# Altium schematic sheet 08_USB_CONTROLLER.SchDoc: =title
size A3; Organization: 六零加智能科技; Address4: www.nidone.com.cn; DocumentNumber: kang jin; Revision: 1.0; SheetNumber: 8; SheetTotal: 23
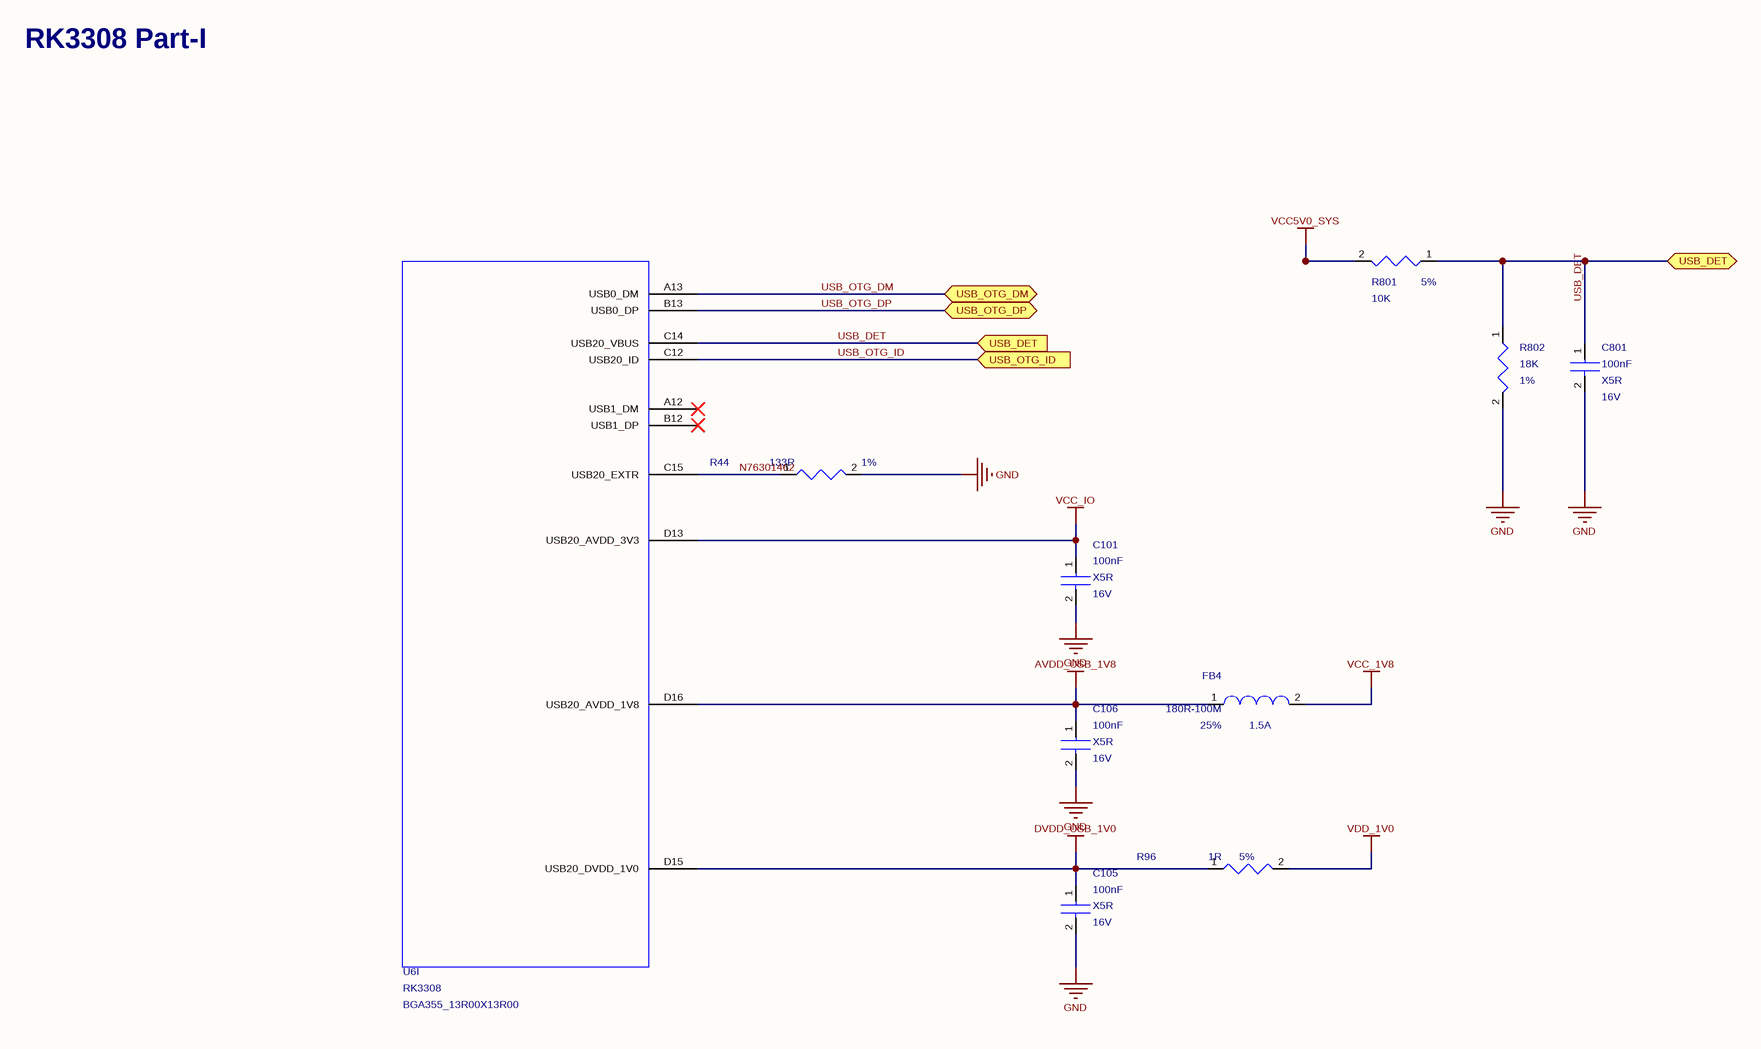
[diagram p0: 08_USB_CONTROLLER.SchDoc]

## Parts
C101  value 100nF  Dielectric: X5R  Voltage: 16V  [C0402]  (hidden comment: CAP_NP_2)
C105  value 100nF  Voltage: 16V  Dielectric: X5R  [C0402]  (hidden comment: CAP_NP_2)
C106  value 100nF  Voltage: 16V  Dielectric: X5R  [C0402]  (hidden comment: CAP_NP_2)
C801  value 100nF  Voltage: 16V  Dielectric: X5R  [C0402]  (hidden comment: CAP_NP_2)
FB4  value 180R-100M  Irms: 1.5A  Tolerance: 25%  [L0603]  (hidden comment: BEAD)
R44  value 133R  Tolerance: 1%  [R0402]  (hidden comment: RESISTOR)
R96  value 1R  Tolerance: 5%  [R0603]  (hidden comment: RESISTOR)
R801  value 10K  Tolerance: 5%  [R0402]  (hidden comment: RESISTOR)
R802  value 18K  Tolerance: 1%  [R0402]  (hidden comment: RESISTOR)
U6  RK3308  [BGA355_13R00X13R00]  (part I of 14)

## Ports
USB_DET (bidir), USB_DET (in), USB_OTG_DM (bidir), USB_OTG_DP (bidir), USB_OTG_ID (in)

## Nets
AVDD_USB_1V8: C106.1 FB4.1 U6.D16(USB20_AVDD_1V8)
DVDD_USB_1V0: C105.1 R96.1 U6.D15(USB20_DVDD_1V0)
GND: C101.2 C105.2 C106.2 C801.2 R44.2 R802.2
VCC5V0_SYS: R801.2
VCC_1V8: FB4.2
VCC_IO: C101.1 U6.D13(USB20_AVDD_3V3)
VDD_1V0: R96.2
N76301462: R44.1 U6.C15(USB20_EXTR)
USB_DET: C801.1 R801.1 R802.1 U6.C14(USB20_VBUS) ; port USB_DET
USB_OTG_DM: U6.A13(USB0_DM) ; port USB_OTG_DM
USB_OTG_DP: U6.B13(USB0_DP) ; port USB_OTG_DP
USB_OTG_ID: U6.C12(USB20_ID) ; port USB_OTG_ID

Not connected (* = marked no-connect by the designer): U6 A12(USB1_DM)* B12(USB1_DP)*

## Notes on the sheet
- RK3308 Part-I
- Title
- Size:
- Date:
- A3
- Engineer:
- Time:
- Revision:
- Sheet
- of
- File:

## Library data of the parts
C101 = CAP_NP_2: cap,100.00nF,+/-10%,16V,X5R,C0402; Manufacturer: TDK; RK_PN: C1005X5R1C104K050BA; Priority: A; Tolerance: 10%; Created_by: JJJ; Source_Path: Z:\RK_STANDARD_LIBRARY\CADENCE_CIS\RK_DISCRETE.OLB; Number: 1; PCB DECAL: C0402; Part_Type: C0402; Manufacturer_PN: C1005X5R1C104K050BA
C105 C106 C801 = CAP_NP_2: cap,100.00nF,+/-10%,16V,X5R,C0402; Manufacturer_PN: C1005X5R1C104K050BA; Manufacturer: TDK; Created_by: JJJ; Tolerance: 10%; Priority: A; Source_Path: Z:\RK_STANDARD_LIBRARY\CADENCE_CIS\RK_DISCRETE.OLB; Number: 1; PCB DECAL: C0402; Part_Type: C0402; RK_PN: C1005X5R1C104K050BA
FB4 = BEAD: Ferrite Bead,180R-100M,0.25,L0603; Manufacturer_PN: BLM18PG181SN1; Manufacturer: Murata; Created_by: YTL; DC_Resistor: 0.09ohm; Priority: A; Source_Path: Z:\RK_STANDARD_LIBRARY\CADENCE_CIS\RK_DISCRETE.OLB; Part_Type: BEAD; RK_PN: BLM18PG181SN1; PCB DECAL: L0603
R44 = RESISTOR: ?用厚膜电阻,133R,+/-1%,R0402,1/16W.; Manufacturer_PN: RC0402FR-07133RL; Manufacturer: YAGEO; Created_by: YTL; Wattage: 1/16W; Priority: A; Source_Path: Z:\RK_STANDARD_LIBRARY\CADENCE_CIS\RK_DISCRETE.OLB; Part_Type: ?用厚膜电阻; RK_PN: RC0402FR-07133RL; PCB DECAL: R0402
R96 = RESISTOR: ?用厚膜电阻,1R,+/-5%,R0603,1/10W.; Manufacturer: YAGEO; RK_PN: RC0603JR-071RL; Priority: A; Wattage: 1/10W; Created_by: YTL; Source_Path: Z:\RK_STANDARD_LIBRARY\CADENCE_CIS\RK_DISCRETE.OLB; PCB DECAL: R0603; Part_Type: ?用厚膜电阻; Manufacturer_PN: RC0603JR-071RL
R801 = RESISTOR: ?用厚膜电阻,10K,+/-5%,R0402,1/16W.; Manufacturer_PN: RC0402JR-0710KL; Manufacturer: YAGEO; Created_by: YTL; Wattage: 1/16W; Priority: A; Source_Path: Z:\RK_STANDARD_LIBRARY\CADENCE_CIS\RK_DISCRETE.OLB; PCB DECAL: R0402; Part_Type: ?用厚膜电阻; RK_PN: RC0402JR-0710KL
R802 = RESISTOR: ?用厚膜电阻,18K,+/-1%,R0402,1/16W.; Manufacturer: YAGEO; RK_PN: RC0402FR-0718KL; Priority: A; Wattage: 1/16W; Created_by: YTL; Source_Path: Z:\RK_STANDARD_LIBRARY\CADENCE_CIS\RK_DISCRETE.OLB; PCB DECAL: R0402; Part_Type: ?用厚膜电阻; Manufacturer_PN: RC0402FR-0718KL
U6 = RK3308: Manufacturer: ROCKCHIP; Source_Path: E:\SCHEMETIC\RKSCH.OLB; Number: 1; PCB DECAL: BGA355_13R00X13R00; Value: RK3308; Manufacturer_PN: RK3308